# EAGLE design classd (EAGLE 9.2.2)
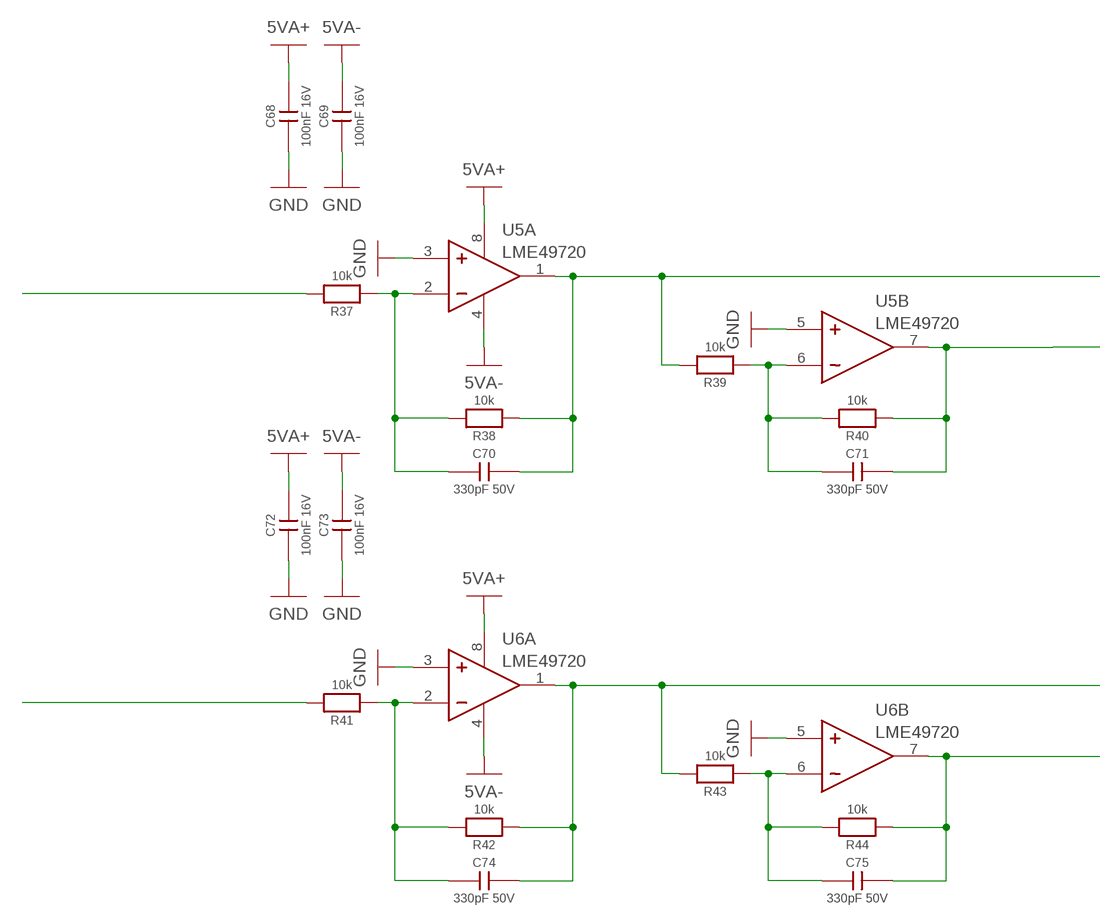
[diagram p0: schematic, sheet 1, part 1 of 2]
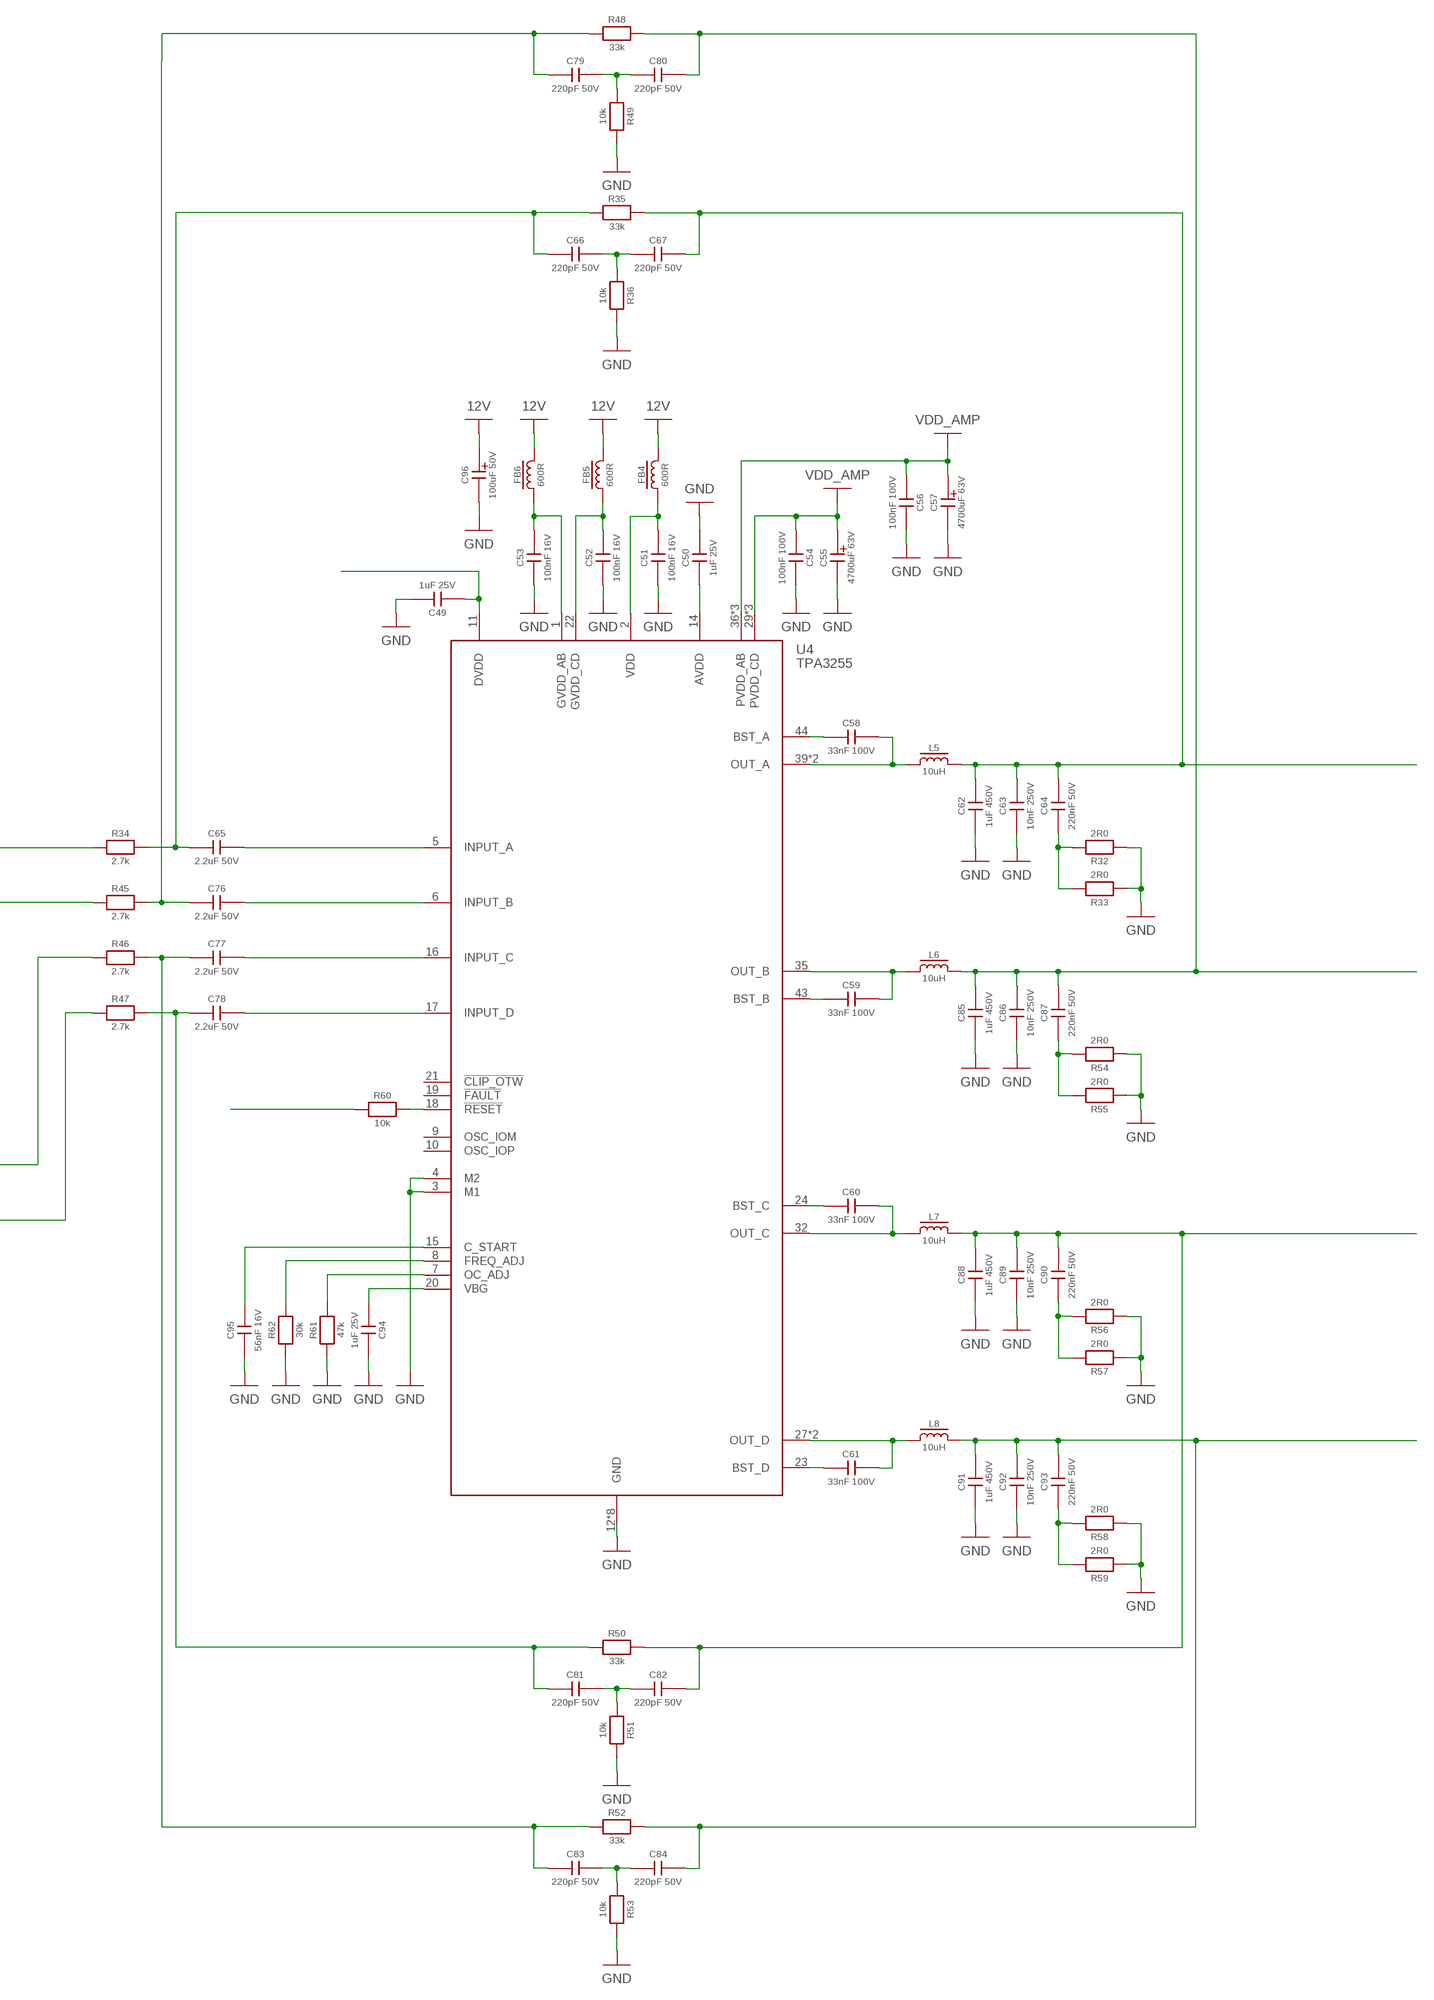
[diagram p1: schematic, sheet 1, part 2 of 2]

## Parts
C49  1uF 25V  CL10A105KA8NNNC  [0603]
C50  1uF 25V  CL10A105KA8NNNC  [0603]
C51  100nF 16V  CL10B104KO8WPNC  [0603]
C52  100nF 16V  CL10B104KO8WPNC  [0603]
C53  100nF 16V  CL10B104KO8WPNC  [0603]
C54  100nF 100V  06031C104KAT2A  [0603]
C55  4700uF 63V  B41231C8478M000  [30MM_RADIAL_10MM_PITCH]
C56  100nF 100V  06031C104KAT2A  [0603]
C57  4700uF 63V  B41231C8478M000  [30MM_RADIAL_10MM_PITCH]
C58  33nF 100V  C0603C333K1RACTU  [0603]
C59  33nF 100V  C0603C333K1RACTU  [0603]
C60  33nF 100V  C0603C333K1RACTU  [0603]
C61  33nF 100V  C0603C333K1RACTU  [0603]
C62  1uF 450V  ECWFE2W105K  [7X17.5BOX]
C63  10nF 250V  885342206006  [0603]
C64  220nF 50V  C1608X7R1H224K080AB  [0603]
C65  2.2uF 50V  MKS2B042201F00KSSD  [5X7.2BOX]
C66  220pF 50V  CC0603JRNPO9BN221  [0603]
C67  220pF 50V  CC0603JRNPO9BN221  [0603]
C68  100nF 16V  CL10B104KO8WPNC  [0603]
C69  100nF 16V  CL10B104KO8WPNC  [0603]
C70  330pF 50V  CC0603JRNPO9BN331  [0603]
C71  330pF 50V  CC0603JRNPO9BN331  [0603]
C72  100nF 16V  CL10B104KO8WPNC  [0603]
C73  100nF 16V  CL10B104KO8WPNC  [0603]
C74  330pF 50V  CC0603JRNPO9BN331  [0603]
C75  330pF 50V  CC0603JRNPO9BN331  [0603]
C76  2.2uF 50V  MKS2B042201F00KSSD  [5X7.2BOX]
C77  2.2uF 50V  MKS2B042201F00KSSD  [5X7.2BOX]
C78  2.2uF 50V  MKS2B042201F00KSSD  [5X7.2BOX]
C79  220pF 50V  CC0603JRNPO9BN221  [0603]
C80  220pF 50V  CC0603JRNPO9BN221  [0603]
C81  220pF 50V  CC0603JRNPO9BN221  [0603]
C82  220pF 50V  CC0603JRNPO9BN221  [0603]
C83  220pF 50V  CC0603JRNPO9BN221  [0603]
C84  220pF 50V  CC0603JRNPO9BN221  [0603]
C85  1uF 450V  ECWFE2W105K  [7X17.5BOX]
C86  10nF 250V  885342206006  [0603]
C87  220nF 50V  C1608X7R1H224K080AB  [0603]
C88  1uF 450V  ECWFE2W105K  [7X17.5BOX]
C89  10nF 250V  885342206006  [0603]
C90  220nF 50V  C1608X7R1H224K080AB  [0603]
C91  1uF 450V  ECWFE2W105K  [7X17.5BOX]
C92  10nF 250V  885342206006  [0603]
C93  220nF 50V  C1608X7R1H224K080AB  [0603]
C94  1uF 25V  CL10A105KA8NNNC  [0603]
C95  56nF 16V  GRM188R71C563JA01D  [0603]
C96  100uF 50V  107CKR050M  [8MM_RADIAL_3.5MM_PITCH]
FB4  600R  742792651  [0603]
FB5  600R  742792651  [0603]
FB6  600R  742792651  [0603]
L5  10uH  SRP1265A-100M  [SRP1265A]
L6  10uH  SRP1265A-100M  [SRP1265A]
L7  10uH  SRP1265A-100M  [SRP1265A]
L8  10uH  SRP1265A-100M  [SRP1265A]
R32  2R0  CRCW12062R00FNEA  [1206]
R33  2R0  CRCW12062R00FNEA  [1206]
R34  2.7k  ERJ3EKF2701V  [0603]
R35  33k  ERJ3EKF3302V  [0603]
R36  10k  ERJ3EKF1002V  [0603]
R37  10k  ERJ3EKF1002V  [0603]
R38  10k  ERJ3EKF1002V  [0603]
R39  10k  ERJ3EKF1002V  [0603]
R40  10k  ERJ3EKF1002V  [0603]
R41  10k  ERJ3EKF1002V  [0603]
R42  10k  ERJ3EKF1002V  [0603]
R43  10k  ERJ3EKF1002V  [0603]
R44  10k  ERJ3EKF1002V  [0603]
R45  2.7k  ERJ3EKF2701V  [0603]
R46  2.7k  ERJ3EKF2701V  [0603]
R47  2.7k  ERJ3EKF2701V  [0603]
R48  33k  ERJ3EKF3302V  [0603]
R49  10k  ERJ3EKF1002V  [0603]
R50  33k  ERJ3EKF3302V  [0603]
R51  10k  ERJ3EKF1002V  [0603]
R52  33k  ERJ3EKF3302V  [0603]
R53  10k  ERJ3EKF1002V  [0603]
R54  2R0  CRCW12062R00FNEA  [1206]
R55  2R0  CRCW12062R00FNEA  [1206]
R56  2R0  CRCW12062R00FNEA  [1206]
R57  2R0  CRCW12062R00FNEA  [1206]
R58  2R0  CRCW12062R00FNEA  [1206]
R59  2R0  CRCW12062R00FNEA  [1206]
R60  10k  ERJ3EKF1002V  [0603]
R61  47k  ERJ3EKF4702V  [0603]
R62  30k  ERJ3EKF3002V  [0603]
U4  TPA3255  [HTSSOP44]
U5  LME49720  LME49720MA/NOPB  [SO8]
U6  LME49720  LME49720MA/NOPB  [SO8]

## Nets
5VA+: C68.2 C72.2 U5.8(A:V+) U6.8(A:V+)
5VA-: C69.2 C73.2 U5.4(A:V-) U6.4(A:V-)
12V: C96.P(A) FB4.2 FB5.2 FB6.2
GND: C49.2 C50.2 C51.1 C52.1 C53.1 C54.2 C55.1(K) C56.2 C57.1(K) C62.1 C63.1 C68.1 C69.1 C72.1 C73.1 C85.1 C86.1 C88.1 C89.1 C91.1 C92.1 C94.2 C95.1 C96.N(K) R32.1 R33.1 R36.2 R49.2 R51.2 R53.2 R54.1 R55.1 R56.1 R57.1 R58.1 R59.1 R61.1 R62.1 U4.3(M1) U4.4(M2) U4.12(GND) U4.13(GND) U4.25(GND) U4.26(GND) U4.33(GND) U4.34(GND) U4.41(GND) U4.42(GND) U5.3(A:+) U5.5(B:+) U6.3(A:+) U6.5(B:+)
N$1: C50.1 U4.14(AVDD)
N$25: C51.2 FB4.1 U4.2(VDD)
N$31: C52.2 FB5.1 U4.22(GVDD_CD)
N$51: C53.2 FB6.1 U4.1(GVDD_AB)
N$52: C61.1 U4.23(BST_D)
N$53: C61.2 L8.1 U4.27(OUT_D) U4.28(OUT_D)
N$54: C60.1 U4.24(BST_C)
N$55: C60.2 L7.1 U4.32(OUT_C)
N$56: C59.1 U4.43(BST_B)
N$57: C59.2 L6.1 U4.35(OUT_B)
N$58: C58.1 U4.44(BST_A)
N$59: C58.2 L5.1 U4.39(OUT_A) U4.40(OUT_A)
N$60: C64.1 R32.2 R33.2
N$61: C65.2 U4.5(INPUT_A)
N$62: C65.1 C66.1 R34.2 R35.1
N$63: C62.2 C63.2 C64.2 C67.2 L5.2 R35.2
N$64: C66.2 C67.1 R36.1
N$65: C70.2 R34.1 R38.1 R39.2 U5.1(A:OUT)
N$66: C70.1 R37.1 R38.2 U5.2(A:-)
N$67: R37.2
N$68: C71.2 R40.1 R45.1 U5.7(B:OUT)
N$69: C71.1 R39.1 R40.2 U5.6(B:-)
N$70: C74.2 R42.1 R43.2 R46.1 U6.1(A:OUT)
N$71: C74.1 R41.1 R42.2 U6.2(A:-)
N$72: R41.2
N$73: C75.2 R44.1 R47.1 U6.7(B:OUT)
N$74: C75.1 R43.1 R44.2 U6.6(B:-)
N$75: C76.2 U4.6(INPUT_B)
N$76: C77.2 U4.16(INPUT_C)
N$77: C78.2 U4.17(INPUT_D)
N$78: C76.1 C79.1 R45.2 R48.1
N$79: C80.2 C85.2 C86.2 C87.2 L6.2 R48.2
N$80: C79.2 C80.1 R49.1
N$81: C78.1 C81.1 R47.2 R50.1
N$82: C82.2 C88.2 C89.2 C90.2 L7.2 R50.2
N$83: C81.2 C82.1 R51.1
N$84: C77.1 C83.1 R46.2 R52.1
N$85: C84.2 C91.2 C92.2 C93.2 L8.2 R52.2
N$86: C83.2 C84.1 R53.1
N$87: C87.1 R54.2 R55.2
N$88: C90.1 R56.2 R57.2
N$89: C93.1 R58.2 R59.2
N$90: R60.2 U4.18(!RESET)
N$91: C94.1 U4.20(VBG)
N$92: R61.2 U4.7(OC_ADJ)
N$93: R62.2 U4.8(FREQ_ADJ)
N$94: C95.2 U4.15(C_START)
TPA_VDD_1: C49.1 R60.1 U4.11(DVDD)
VDD_AMP: C54.1 C55.2(A) C56.1 C57.2(A) U4.29(PVDD_CD) U4.30(PVDD_CD) U4.31(PVDD_CD) U4.36(PVDD_AB) U4.37(PVDD_AB) U4.38(PVDD_AB)
Unconnected: U4.9(OSC_IOM) U4.10(OSC_IOP) U4.19(!FAULT) U4.21(!CLIP_OTW)

## Library data of the parts
C49 C50 C94 = CAPACITORS:CL10A105KA8NNNC: 1uF 25V X5R 10% 0603 MLCC.; DIGIKEY: 1276-1102-1-ND; HEIGHT: 1; PRICE_PER: 0.08
C51-C53 C68 C69 C72 C73 = CAPACITORS:CL10B104KO8WPNC: 100nF 16V X7R 10% 0603 MLCC; DIGIKEY: 1276-6582-1-ND; HEIGHT: 1; PRICE_PER: 0.08
C54 C56 = CAPACITORS:06031C104KAT2A: 100nF 100V X7R 10% 0603 MLCC.; FARNELL: 2749806; PRICE_PER: 0.0716
C55 C57 = CAPACITORS:B41231C8478M000: 4700uF 63V Electrolytic 20% 10mm radial.; DIGIKEY: 495-6169-ND; HEIGHT: 37; PRICE_PER: 2.62
C58-C61 = CAPACITORS:C0603C333K1RACTU: 33nF 100V X7R 10% 0603 MLCC.; FARNELL: 1865549; HEIGHT: 1; PRICE_PER: 0.214
C62 C85 C88 C91 = CAPACITORS:ECWFE2W105K: 1uF 450V Film 10% box; DIGIKEY: P16846-ND; HEIGHT: 13; PRICE_PER: 0.49
C63 C86 C89 C92 = CAPACITORS:885342206006: 10nF 250V X7R 10% 0603 MLCC.; DIGIKEY: 732-12168-1-ND; HEIGHT: 1; PRICE_PER: 0.09
C64 C87 C90 C93 = CAPACITORS:C1608X7R1H224K080AB: 220nF 50V X7R 10% 0603 MLCC.; FARNELL: 2346906; HEIGHT: 1; PRICE_PER: 0.0536
C65 C76-C78 = CAPACITORS:MKS2B042201F00KSSD: 2.2uF 50V FILM 10% 7.2 x 5mm BOX; FARNELL: 107422; HEIGHT: 10; PRICE_PER: 1.28
C66 C67 C79-C84 = CAPACITORS:CC0603JRNPO9BN221: 220pF 50V C0G/NP0 5% 0603 MLCC; DIGIKEY: 311-1073-1-ND; HEIGHT: 1; PRICE_PER: 0.08
C70 C71 C74 C75 = CAPACITORS:CC0603JRNPO9BN331: 330pF 50V C0G/NP0 5% 0603 MLCC; DIGIKEY: 311-1075-1-ND; HEIGHT: 1; PRICE_PER: 0.1
C95 = CAPACITORS:GRM188R71C563JA01D: 56nF 16V X7R 10% 0603 MLCC.; DIGIKEY: 490-12540-1-ND; HEIGHT: 0.9; PRICE_PER: 0.14
C96 = CAPACITORS:107CKR050M: 100uF 50V Electrolytic 20% 8mm radial.; DIGIKEY: 1572-1044-ND; HEIGHT: 14; PRICE_PER: 0.223
FB4-FB6 = INDUCTORS:742792651: Ferrite Bead 600R at 100MHz 0603.; FARNELL: 1635706
L5-L8 = INDUCTORS:SRP1265A-100M: Power Inductor (SMD), 10 µH, 10 A, Shielded, 15.5 A, SRP1265A Series, 13.5mm x 12.5mm x 6.2mm; FARNELL: 2434072; HEIGHT: 6.2; PRICE_PER: 1.32
R32 R33 R54-R59 = RESISTORS:CRCW12062R00FNEA: 2 2R0 1206 0.25W 1% thick film resistor; FARNELL: 1653107; HEIGHT: 0.65; PRICE_PER: 0.0375
R34 R45-R47 = r_0603:ERJ3EKF2701V: 2700 2.7k 0603 0.1W 1% thick film resistor.; DIGIKEY: P2.70KHCT-ND; PRICE_PER: 0.10000
R35 R48 R50 R52 = r_0603:ERJ3EKF3302V: 33000 33k 0603 0.1W 1% thick film resistor.; DIGIKEY: P33.0KHCT-ND; PRICE_PER: 0.10000
R36-R44 R49 R51 R53 R60 = r_0603:ERJ3EKF1002V: 10000 10k 0603 0.1W 1% thick film resistor.; DIGIKEY: P10.0KHCT-ND; PRICE_PER: 0.10000
R61 = r_0603:ERJ3EKF4702V: 47000 47k 0603 0.1W 1% thick film resistor.; DIGIKEY: P47.0KHCT-ND; PRICE_PER: 0.10000
R62 = r_0603:ERJ3EKF3002V: 30000 30k 0603 0.1W 1% thick film resistor.; DIGIKEY: P30.0KHCT-ND; PRICE_PER: 0.10000
U4 = ICs:TPA3255: 315-W Stereo, 600-W Mono PurePath™ Ultra-HD Analog-Input; DIGIKEY: 296-45124-5-ND; HEIGHT: 1.2; PRICE_PER: 8.67
U5 U6 = ICs:LME49720: LME49720 Dual High Performance, High Fidelity Audio Operational Amplifier. 0.00003% THD, +/-17V.; FARNELL: 1564794; PRICE_PER: 2.15

## Board
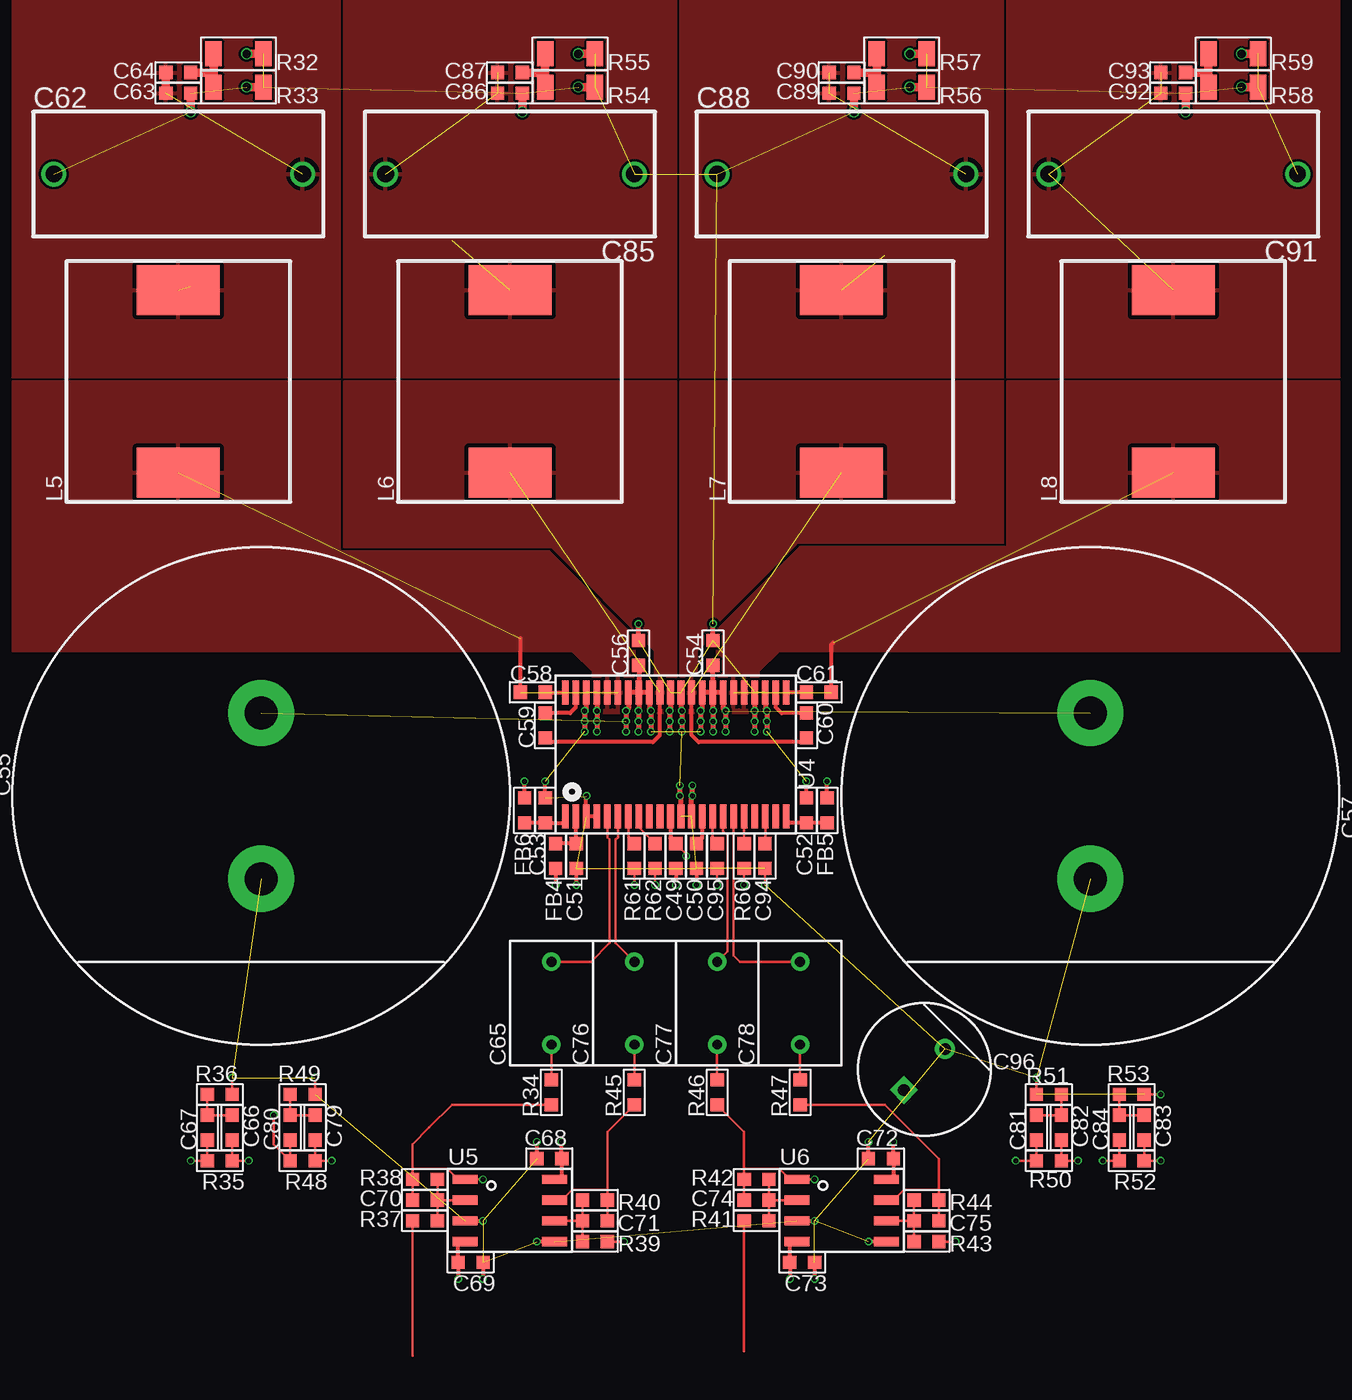
[diagram p2: board, top side]
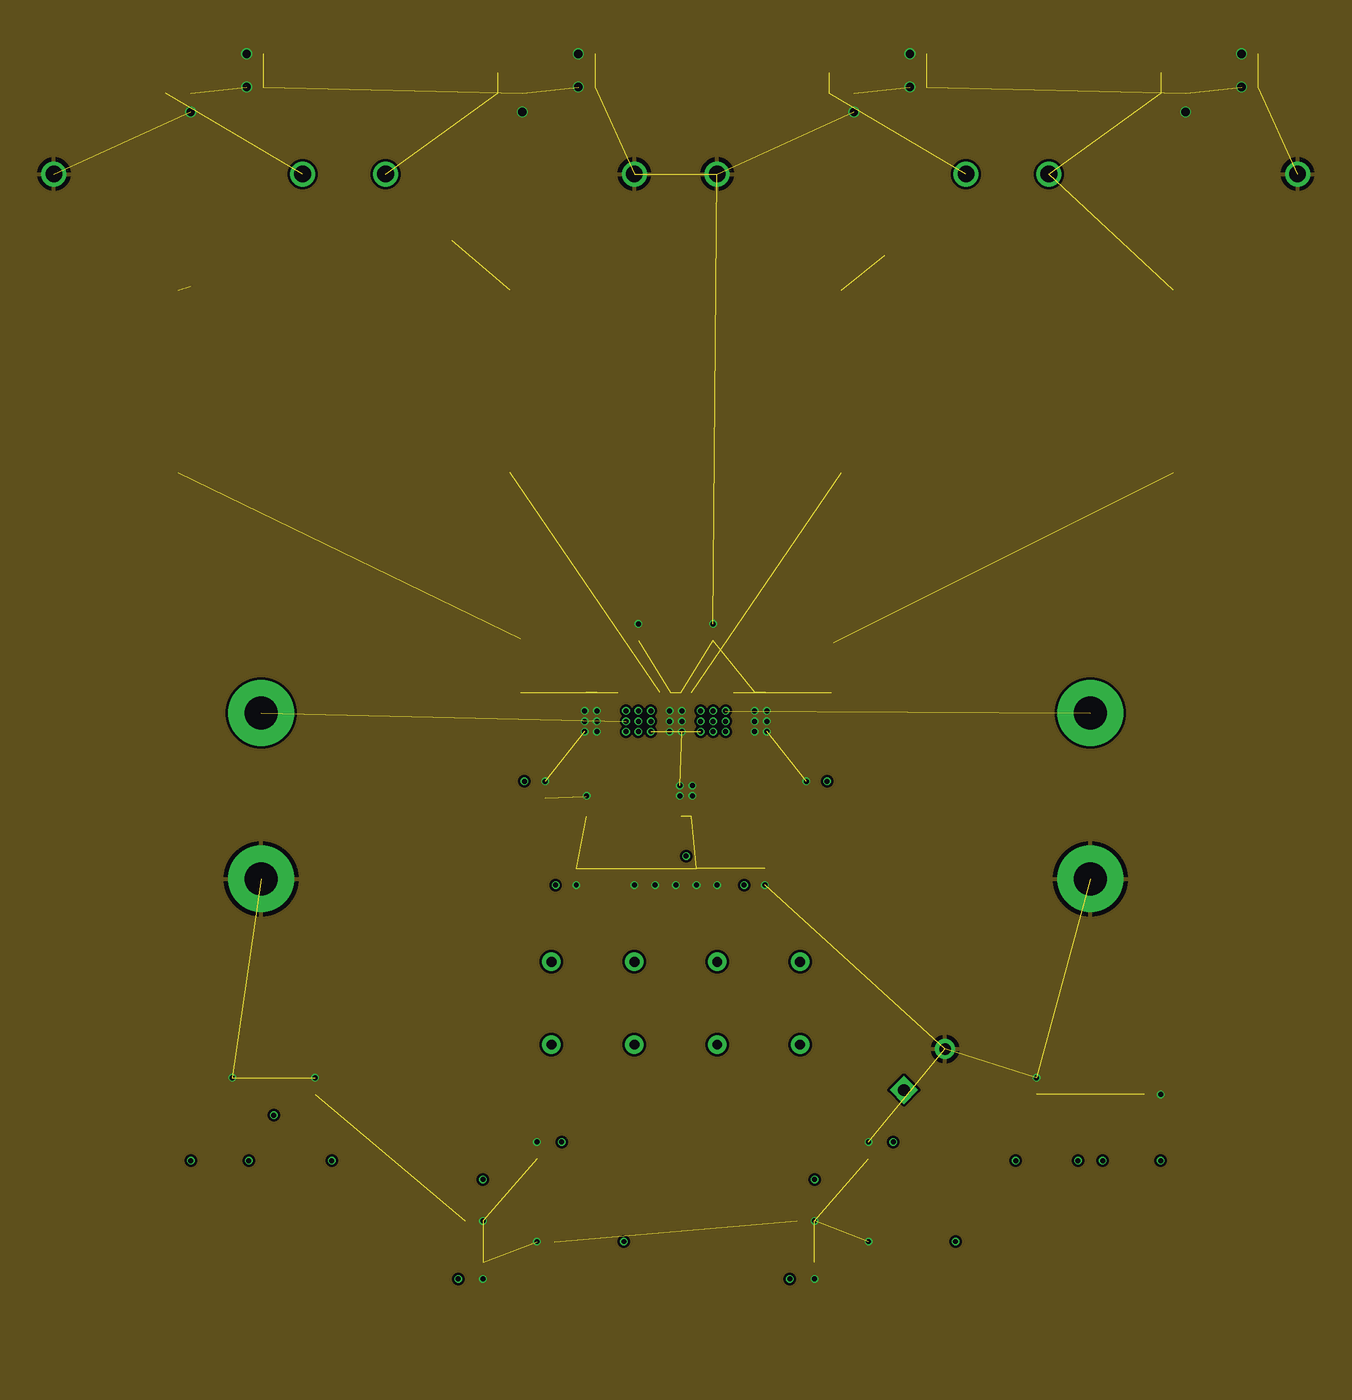
[diagram p3: board, inner layer GND]
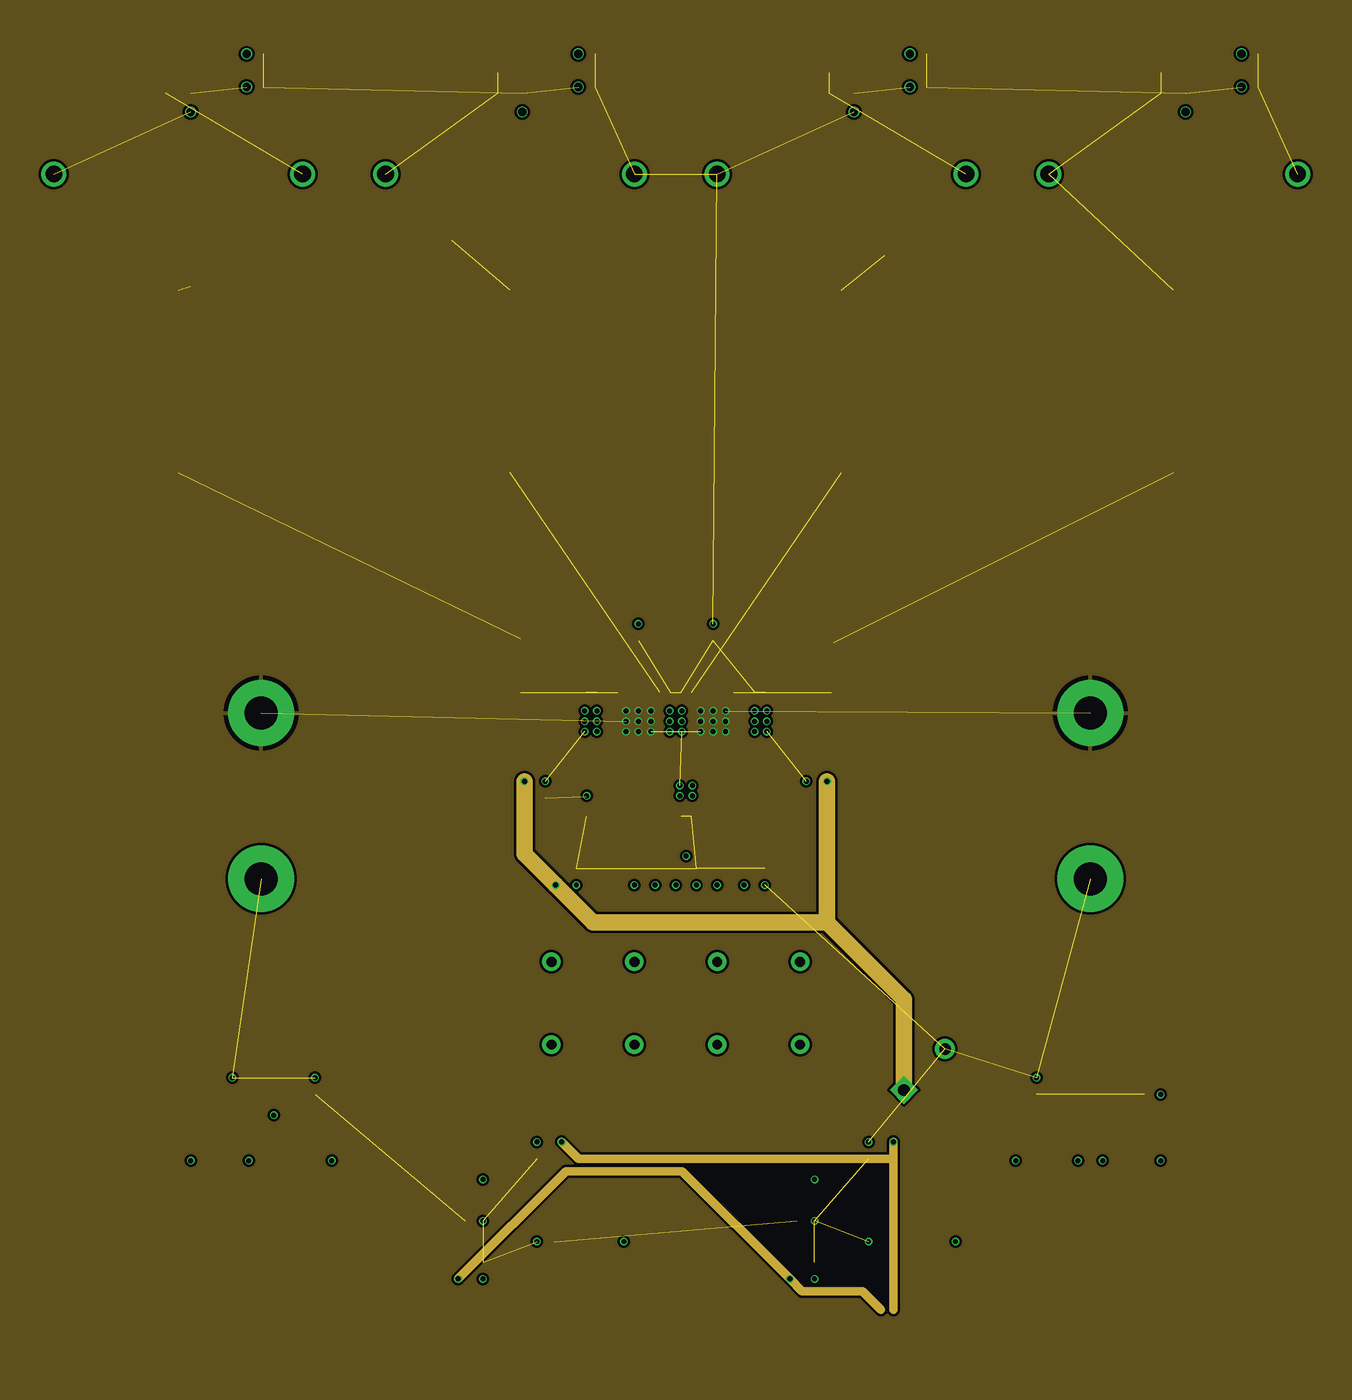
[diagram p4: board, inner layer PWR]
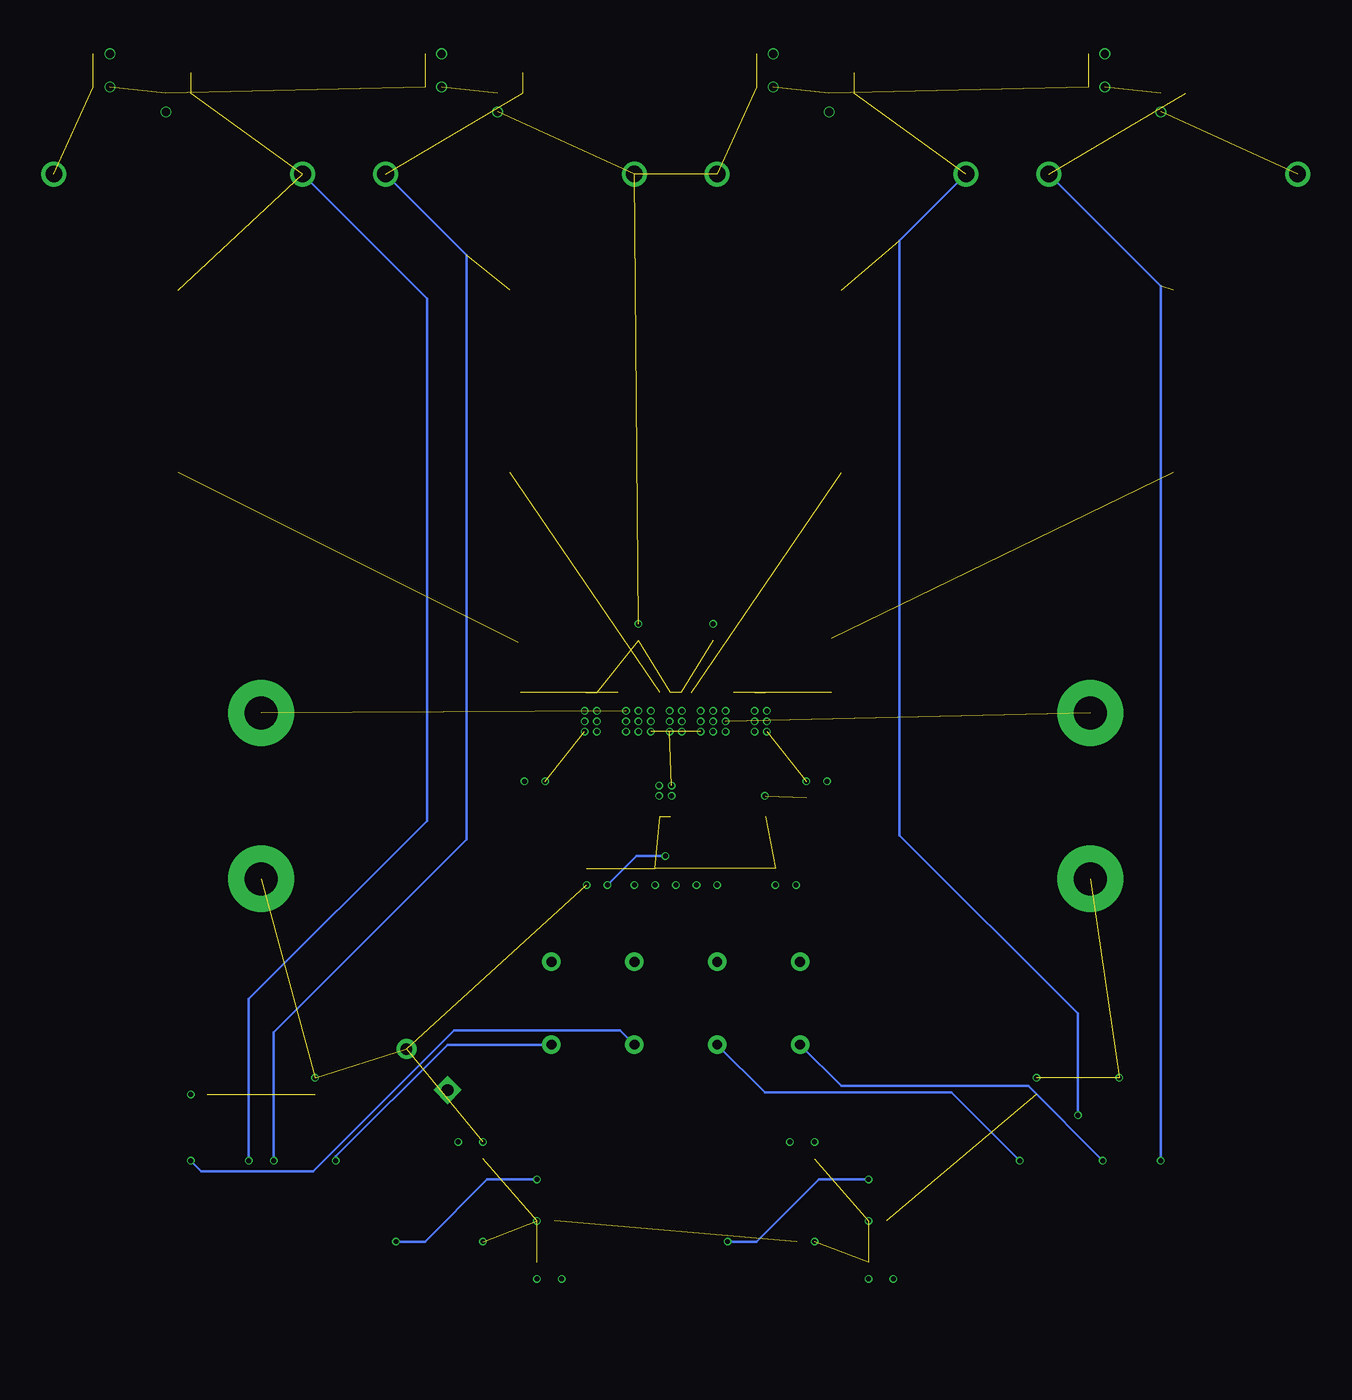
[diagram p5: board, bottom side, seen from below]

No outline drawn. Coordinates in mm, seen from the top.
Copper layers (1*2*3*16): Top 0.035mm / dielectric 1.5mm / GND 0.035mm / dielectric 0.15mm / PWR 0.035mm / dielectric 0.2mm / Bottom 0.035mm
Design rules "myDRC 4 layers 0.25mm": minimum track width 0.15mm, minimum drill 0.25mm, track to track 0.15mm, track to pad 0.15mm, pad to pad 0.15mm, via to via 0.15mm, smd to smd 0mil, copper to edge 0.25mm, drill to drill 0.25mm, minimum pad ring 10mil, minimum via ring 3mil, stop-mask expansion 4mil, vias tented up to drill 0.3mm, thermal gap 10mil

### Footprints (pad centres in the part's own frame; a part is rotated, then mirrored left to right if it is on the bottom)
0603 = smd 0.8 x 0.8: 1 -0.75,0; 2 0.75,0
30MM_RADIAL_10MM_PITCH = drill 2 pad 4: 1 5,0; 2 -5,0
7X17.5BOX = drill 1: 1 -7.5,0; 2 7.5,0
5X7.2BOX = drill 0.6: 1 -2.5,0; 2 2.5,0
8MM_RADIAL_3.5MM_PITCH = drill 0.7: N 1.75,0 | drill 0.7 square: P -1.75,0
SRP1265A = smd 3 x 5: 1 -5.5,0; 2 5.5,0
1206 = smd 1 x 1.5: 1 1.5,0; 2 -1.5,0
HTSSOP44 = smd 1.45 x 0.4: 1 -3.75,6.668; 2 -3.75,6.032; 3 -3.75,5.397; 4 -3.75,4.763; 5 -3.75,4.128; 6 -3.75,3.493; 7 -3.75,2.857; 8 -3.75,2.223; 9 -3.75,1.587; 10 -3.75,0.953; 11 -3.75,0.318; 12 -3.75,-0.318; 13 -3.75,-0.953; 14 -3.75,-1.587; 15 -3.75,-2.223; 16 -3.75,-2.857; 17 -3.75,-3.493; 18 -3.75,-4.128; 19 -3.75,-4.763; 20 -3.75,-5.397; 21 -3.75,-6.032; 22 -3.75,-6.668; 23 3.75,-6.668; 24 3.75,-6.032; 25 3.75,-5.397; 26 3.75,-4.763; 27 3.75,-4.128; 28 3.75,-3.493; 29 3.75,-2.857; 30 3.75,-2.223; 31 3.75,-1.587; 32 3.75,-0.953; 33 3.75,-0.318; 34 3.75,0.318; 35 3.75,0.953; 36 3.75,1.587; 37 3.75,2.223; 38 3.75,2.857; 39 3.75,3.493; 40 3.75,4.128; 41 3.75,4.763; 42 3.75,5.397; 43 3.75,6.032; 44 3.75,6.668
SO8 = smd 1.5 x 0.55: 1 -2.7,1.875; 2 -2.7,0.625; 3 -2.7,-0.625; 4 -2.7,-1.875; 5 2.7,-1.875; 6 2.7,-0.625; 7 2.7,0.625; 8 2.7,1.875

### Placement (x,y rotation side)
C49  50,43.88 270 top
C50  51.25,43.88 270 top
C51  44,43.88 90 top
C52  57.88,46.62 270 top
C53  42.12,46.62 270 top
C54  52.25,56.12 90 top
C55  25,47.5 270 top
C56  47.75,56.12 90 top
C57  75,47.5 270 top
C58  41.38,53.75 180 top
C59  42.12,51.75 270 top
C60  57.88,51.75 270 top
C61  58.62,53.75 0 top
C62  20,85 0 top
C63  20,89.88 180 top
C64  20,91.12 180 top
C65  42.5,35 90 top
C66  23.25,27.5 90 top
C67  21.75,27.5 270 top
C68  42.38,25.62 0 top
C69  37.62,19.38 180 top
C70  34.88,23.12 180 top
C71  45.12,21.88 0 top
C72  62.38,25.62 0 top
C73  57.62,19.38 180 top
C74  54.88,23.12 180 top
C75  65.12,21.88 0 top
C76  47.5,35 90 top
C77  52.5,35 90 top
C78  57.5,35 90 top
C79  28.25,27.5 90 top
C80  26.75,27.5 270 top
C81  71.75,27.5 90 top
C82  73.25,27.5 270 top
C83  78.25,27.5 90 top
C84  76.75,27.5 270 top
C85  40,85 180 top
C86  40,89.88 180 top
C87  40,91.12 180 top
C88  60,85 0 top
C89  60,89.88 180 top
C90  60,91.12 180 top
C91  80,85 180 top
C92  80,89.88 180 top
C93  80,91.12 180 top
C94  55.38,43.88 270 top
C95  52.5,43.88 90 top
C96  65,31 45 top
FB4  42.75,43.88 270 top
FB5  59.12,46.62 90 top
FB6  40.88,46.62 90 top
L5  20,72.5 90 top
L6  40,72.5 90 top
L7  60,72.5 90 top
L8  80,72.5 90 top
R32  23.62,92.25 0 top
R33  23.62,90.25 0 top
R34  42.5,29.62 90 top
R35  22.5,25.5 180 top
R36  22.5,29.5 0 top
R37  34.88,21.88 180 top
R38  34.88,24.38 0 top
R39  45.12,20.62 0 top
R40  45.12,23.12 180 top
R41  54.88,21.88 180 top
R42  54.88,24.38 0 top
R43  65.12,20.62 0 top
R44  65.12,23.12 180 top
R45  47.5,29.62 90 top
R46  52.5,29.62 90 top
R47  57.5,29.62 90 top
R48  27.5,25.5 180 top
R49  27.5,29.5 0 top
R50  72.5,25.5 0 top
R51  72.5,29.5 180 top
R52  77.5,25.5 180 top
R53  77.5,29.5 0 top
R54  43.62,90.25 0 top
R55  43.62,92.25 0 top
R56  63.62,90.25 0 top
R57  63.62,92.25 0 top
R58  83.62,90.25 0 top
R59  83.62,92.25 0 top
R60  54.12,43.88 90 top
R61  47.5,43.88 90 top
R62  48.75,43.88 90 top
U4  50,50 90 top
U5  40,22.5 0 top
U6  60,22.5 0 top

### Tracks (layer width: path | path; a pad name or v marks a point on that pad's centre or on a via)
5VA+  (via drill 0.3)
  Top 0.25: U5.8 43.08,24.38 43.12,24.43 C68.2 v43.12,26.62 | U6.8 63.08,24.38 63.12,24.43 C72.2 v63.12,26.62
  PWR 0.5: v63.12,26.62 C72.2 | C72.2 63.12,16.5 | v43.12,26.62 44.12,25.62 C72.2
5VA-  (via drill 0.3)
  Top 0.25: U5.4 36.92,20.62 36.88,20.57 C69.2 v36.88,18.38 | U6.4 56.92,20.62 56.88,20.57 C73.2 v56.88,18.38
  PWR 0.5: v36.88,18.38 43.38,24.88 50.38,24.88 v56.88,18.38 57.62,17.62 61.25,17.62 62.38,16.5
12V  (via drill 0.3)
  Top 0.25: FB5.2 v59.12,48.38 | FB4.2 v42.75,42.12 | FB6.2 v40.88,48.38
  PWR 1: C96.P 63.76,35.24 59.12,39.88 | 59.12,39.88 45,39.88 v42.75,42.12 40.88,44 v40.88,48.38 | 59.12,39.88 v59.12,48.38
GND  (via drill 0.3, 0.5)  (50 unrouted)
  Top 0.15: R49.2 v28.25,30.5 | R36.2 v23.25,30.5 | R51.2 v71.75,30.5 | R53.2 v79.25,29.5 | R62.1 v48.75,42.12 | R61.1 v47.5,42.12 | C95.1 v52.5,42.12 | C94.2 v55.38,42.12
  Top 0.25: C49.2 v50,42.12 | C50.2 v51.25,42.12 | C52.1 v57.88,48.38 | C51.1 v44,42.12 | C53.1 v42.12,48.38 | v44.62,47.5 44.6,47.48 U4.3 U4.4 | C69.1 v38.38,18.38 | U5.3 v38.38,21.88 | U5.5 v41.62,20.62 | C68.1 v41.62,26.62 | U6.3 v58.38,21.88 | U6.5 v61.62,20.62 | C73.1 v58.38,18.38 | C72.1 v61.62,26.62
  Top 0.3: U4.33 50.32,52.68 v50.38,52.62 v50.38,52 v50.38,51.38 | U4.34 49.68,52.68 v49.62,52.62 v49.62,52 v49.62,51.38 | U4.41 45.24,52.64 v45.25,52.62 v45.25,52 v45.25,51.38 | U4.42 44.6,52.73 v44.5,52.62 v44.5,52 v44.5,51.38 | U4.26 54.75,53.74 v54.75,52.62 v54.75,52 v54.75,51.38 | U4.25 55.4,52.73 v55.5,52.62 v55.5,52 v55.5,51.38 | U4.12 50.32,47.43 v50.25,47.5 v50.25,48.12 | U4.13 50.95,47.45 v51,47.5 v51,48.12 | C56.2 v47.75,57.88 | C54.2 v52.25,57.88
  Top 0.5: C63.1 v20.75,88.75 | R33.1 v24.12,90.25 | R32.1 v24.12,92.25 | R55.1 v44.12,92.25 | R54.1 v44.12,90.25 | C86.1 v40.75,88.75 | R57.1 v64.12,92.25 | R56.1 v64.12,90.25 | C89.1 v60.75,88.75 | C92.1 v80.75,88.75 | R58.1 v84.12,90.25 | R59.1 v84.12,92.25
  pour GND (isolate 0.15): 0,0 0,100 100,100 100,0
N$1
  Top 0.25: U4.14 51.59,44.96 C50.1
N$25
  Top 0.25: U4.2 43.97,44.66 C51.2 FB4.1
N$31
  Top 0.25: FB5.1 C52.2 56.79,45.88 56.67,46 U4.22
N$51
  Top 0.25: 43.33,46 43.21,45.88 C53.2 FB6.1
  Top 0.3: 43.33,46 U4.1
N$52
  Top 0.25: C61.1 U4.23
N$53  (3 unrouted)
  Top 0.25: C61.2 59.38,56.62 59.5,56.75
  pour Top (isolate 0.15, rank 3): 55,52.5 55,55 56.25,56.25 90,56.25 90,72.5 70,72.5 70,62.5 57.5,62.5 52.5,57.5 52.5,52.5
N$54
  Top 0.25: C60.1 56.38,52.5 56.03,52.84 U4.24
N$55  (1 unrouted)
  Top 0.25: C60.2 57.62,50.75 51.38,50.75 50.95,51.17 U4.32
  pour Top (isolate 0.15, rank 4): 50,52.5 50,72.5 70,72.5 70,62.5 57.5,62.5 51.25,56.25 51.25,52.5
N$56
  Top 0.25: U4.43 43.97,52.84 43.62,52.5 C59.1
N$57  (1 unrouted)
  Top 0.25: U4.35 49.05,51.17 48.62,50.75 42.38,50.75 C59.2
  pour Top (isolate 0.15, rank 3): 48.75,52.5 48.75,56.25 42.5,62.5 30,62.5 30,72.5 50,72.5 50,52.5
N$58
  Top 0.25: C58.1 U4.44
N$59  (3 unrouted)
  Top 0.25: C58.2 40.62,57
  pour Top (isolate 0.15, rank 4): 47.5,52.5 47.5,57.5 42.5,62.5 30,62.5 30,72.5 10,72.5 10,56.25 43.75,56.25 45,55 45,52.5
N$60
  Top 0.5: C64.1 22.12,91.12 | 22.12,91.12 R32.2 | R33.2 22.12,91.12
N$61
  Top 0.15: U4.5 45.87,45 46,44.88 46,38.62 44.88,37.5 C65.2
N$62  (via drill 0.3)
  Top 0.15: R34.2 C65.1 | C66.1 R35.1 v24.25,25.5
  Bottom 0.15: v24.25,25.5 28.75,30 40,30 C65.1
N$63  (via drill 0.3)  (2 unrouted)
  Top 0.15: C67.2 R35.2 v20.75,25.5
  Top 0.5: C64.2 C63.2
  Bottom 0.15: C62.2 20.75,78.25 v20.75,25.5
  pour Top (rank 6): 10,72.5 30,72.5 30,98.75 10,98.75
N$64
  Top 0.15: R36.1 C67.1 C66.2
N$65  (via drill 0.3)
  Top 0.15: 34.12,25 R38.1 C70.2 | 34.12,25 34.12,26.5 35.12,27.5 36.5,28.88 R34.1 | 34.12,25 36.25,25 36.88,24.38 U5.1 v38.38,24.38 | v46.88,20.62 R39.2
  Bottom 0.15: v38.38,24.38 41.38,24.38 45.12,20.62 v46.88,20.62
N$66
  Top 0.15: R37.1 C70.1 | C70.1 R38.2 | C70.1 U5.2
N$67
  Top 0.15: R37.2 34.12,13.75
N$68
  Top 0.15: U5.7 43.12,23.12 43.75,23.75 45.88,23.75 | 45.88,23.75 R40.1 C71.2 | R45.1 45.88,27.25 45.88,23.75
N$69
  Top 0.15: R39.1 C71.1 | U5.6 C71.1 | C71.1 R40.2
N$70  (via drill 0.3)
  Top 0.15: 54.12,25 56.25,25 56.88,24.38 U6.1 v58.38,24.38 | 54.12,25 R42.1 C74.2 | R46.1 54.12,27.25 54.12,25 | v66.88,20.62 R43.2
  Bottom 0.15: v58.38,24.38 61.38,24.38 65.12,20.62 v66.88,20.62
N$71
  Top 0.15: U6.2 C74.1 | R41.1 C74.1 | C74.1 R42.2
N$72
  Top 0.15: R41.2 54.12,14
N$73
  Top 0.15: C75.2 R44.1 65.88,23.75 | U6.7 63.12,23.12 63.75,23.75 65.88,23.75 | R47.1 62.62,28.88 65.88,25.62 65.88,23.75
N$74
  Top 0.15: R43.1 C75.1 | C75.1 U6.6 | C75.1 R44.2
N$75
  Top 0.15: U4.6 46.51,45.01 46.38,44.88 46.38,38.62 C76.2
N$76
  Top 0.15: U4.16 52.86,45.39 53.12,45.12 53.12,38.12 C77.2
N$77
  Top 0.15: U4.17 53.49,37.88 53.88,37.5 C78.2
N$78  (via drill 0.3)
  Top 0.15: R45.2 C76.1 | C79.1 R48.1 v29.25,25.5
  Bottom 0.15: v29.25,25.5 33.38,29.62 44.62,29.62 C76.1
N$79  (via drill 0.3)  (3 unrouted)
  Top 0.15: C80.2 R48.2 25.75,26.5 v25.75,28.25
  Bottom 0.15: v25.75,28.25 25.75,34.38 36.5,45.12 36.5,81 C85.2
  pour Top (rank 5): 30,72.5 50,72.5 50,98.75 30,98.75
N$80
  Top 0.15: C79.2 C80.1 R49.1
N$81  (via drill 0.3)
  Top 0.15: R47.2 C78.1 | C81.1 R50.1 v70.5,25.5
  Bottom 0.15: v70.5,25.5 70.5,25.75 63.75,32.5 63.5,32.5 C78.1
N$82  (via drill 0.3)  (3 unrouted)
  Top 0.15: C82.2 R50.2 v74.25,25.5
  Bottom 0.15: v74.25,25.5 74.25,33.25 62.62,44.88 62.62,80.12 C88.2
  pour Top (rank 6): 50,72.5 70,72.5 70,98.75 50,98.75
N$83
  Top 0.15: R51.1 C82.1 C81.2
N$84  (via drill 0.3)
  Top 0.15: R46.2 C77.1 | v79.25,25.5 R52.1 C83.1
  Bottom 0.15: C77.1 53.38,33.38 63.38,33.38 71.88,24.88 78.62,24.88 v79.25,25.5
N$85  (via drill 0.3)  (3 unrouted)
  Top 0.15: v75.75,25.5 R52.2 C84.2
  Bottom 0.15: v75.75,25.5 75.75,35.25 65,46 65,77.5 C91.2
  pour Top (rank 5): 70,72.5 90,72.5 90,98.75 70,98.75
N$86
  Top 0.15: C83.2 C84.1 R53.1
N$87
  Top 0.5: C87.1 42.12,91.12 | 42.12,91.12 R55.2 | R54.2 42.12,91.12
N$88
  Top 0.5: C90.1 62.12,91.12 | 62.12,91.12 R57.2 | R56.2 62.12,91.12
N$89
  Top 0.5: R58.2 82.12,91.12 | 82.12,91.12 R59.2 | C93.1 82.12,91.12
N$90
  Top 0.15: U4.18 R60.2
N$91
  Top 0.15: U4.20 55.4,44.65 C94.1
N$92
  Top 0.15: U4.7 47.14,44.98 R61.2
N$93
  Top 0.15: U4.8 47.78,45.6 R62.2
N$94
  Top 0.15: U4.15 52.22,44.9 C95.2
TPA_VDD_1  (via drill 0.3)
  Top 0.15: R60.1 v54.12,42.12 | C49.1 50.62,44 v50.62,43.88
  Top 0.25: U4.11 49.68,44.94 C49.1
  Bottom 0.15: v54.12,42.12 52.38,43.88 v50.62,43.88
VDD_AMP  (via drill 0.3)  (3 unrouted)
  Top 0.3: C56.1 47.78,55.35 U4.37 | C54.1 52.22,55.35 U4.30 | U4.30 52.22,52.65 v52.25,52.62 v52.25,52 v52.25,51.38 | U4.37 47.78,52.65 v47.75,52.62 v47.75,52 v47.75,51.38 | U4.30 U4.29 52.86,52.77 v53,52.62 v53,52 v53,51.38 | U4.30 U4.31 51.59,52.71 v51.5,52.62 v51.5,52 v51.5,51.38 | U4.37 U4.36 48.41,52.71 v48.5,52.62 v48.5,52 v48.5,51.38 | U4.37 U4.38 47.14,52.77 v47,52.62 v47,52 v47,51.38
  pour PWR (isolate 0.15): 0,0 0,100 100,100 100,0